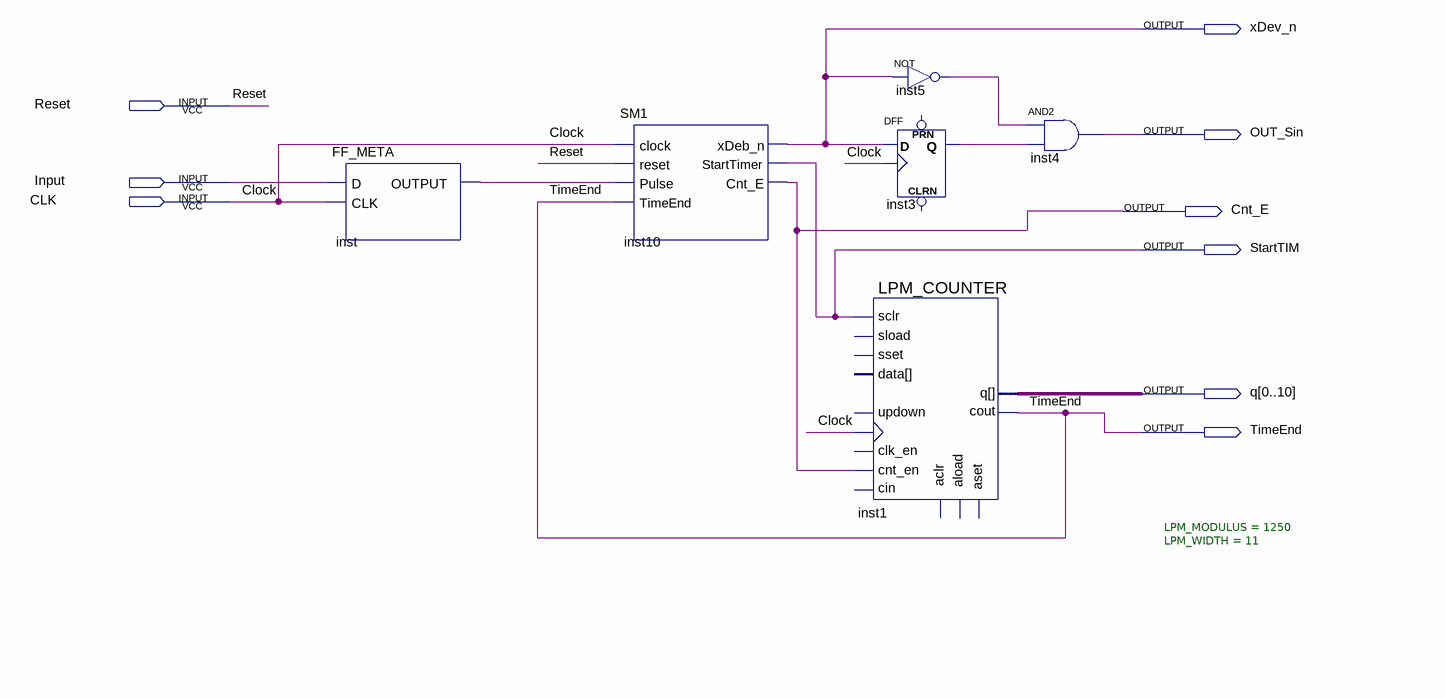
[diagram p0: schematic sheet]
// Quartus schematic AntiRebotes.bdf as structural Verilog: 6 symbols, 9 pins
module AntiRebotes (
  input  Reset,
  input  Input,
  input  CLK,
  output xDev_n,
  output OUT_Sin,
  output Cnt_E,
  output StartTIM,
  output [0:10] q,
  output TimeEnd
);

  wire inst3_q, inst5_out, inst_output;

  FF_META inst (.D(Input), .CLK(CLK), .OUTPUT(inst_output));
  SM1 inst10 (
    .clock(CLK), .reset(Reset), .Pulse(inst_output), .TimeEnd(TimeEnd), .xDeb_n(xDev_n),
    .StartTimer(StartTIM), .Cnt_E(Cnt_E));
  LPM_COUNTER #(.LPM_MODULUS(1250), .LPM_WIDTH(11)) inst1 (
    .clock(CLK), .cnt_en(Cnt_E), .sclr(StartTIM), .q(q), .cout(TimeEnd));  // open: sload, data, clk_en, aload, aclr, aset, cin, sset, updown
  not inst5 (inst5_out, xDev_n);
  DFF inst3 (.CLK(CLK), .D(xDev_n), .Q(inst3_q));  // open: CLRN, PRN
  and inst4 (OUT_Sin, inst5_out, inst3_q);

  // Other names for the same wires on the sheet: Clock = CLK
endmodule
